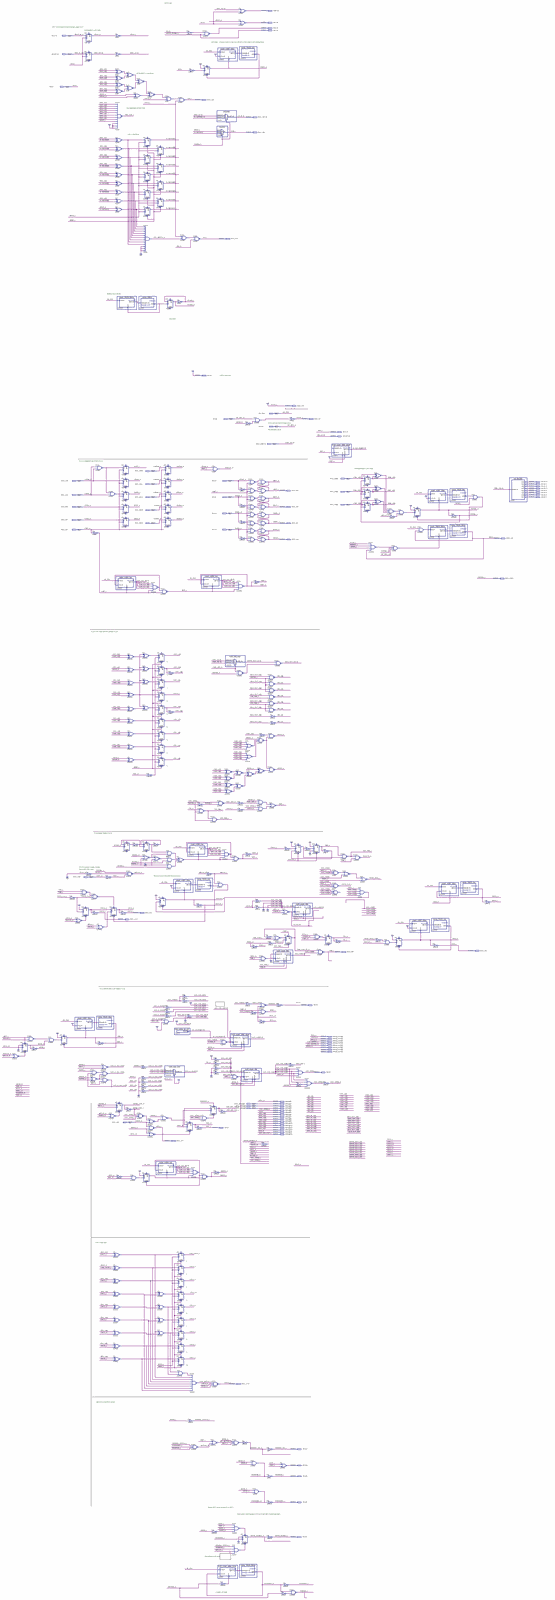
[diagram p0: schematic sheet, whole]
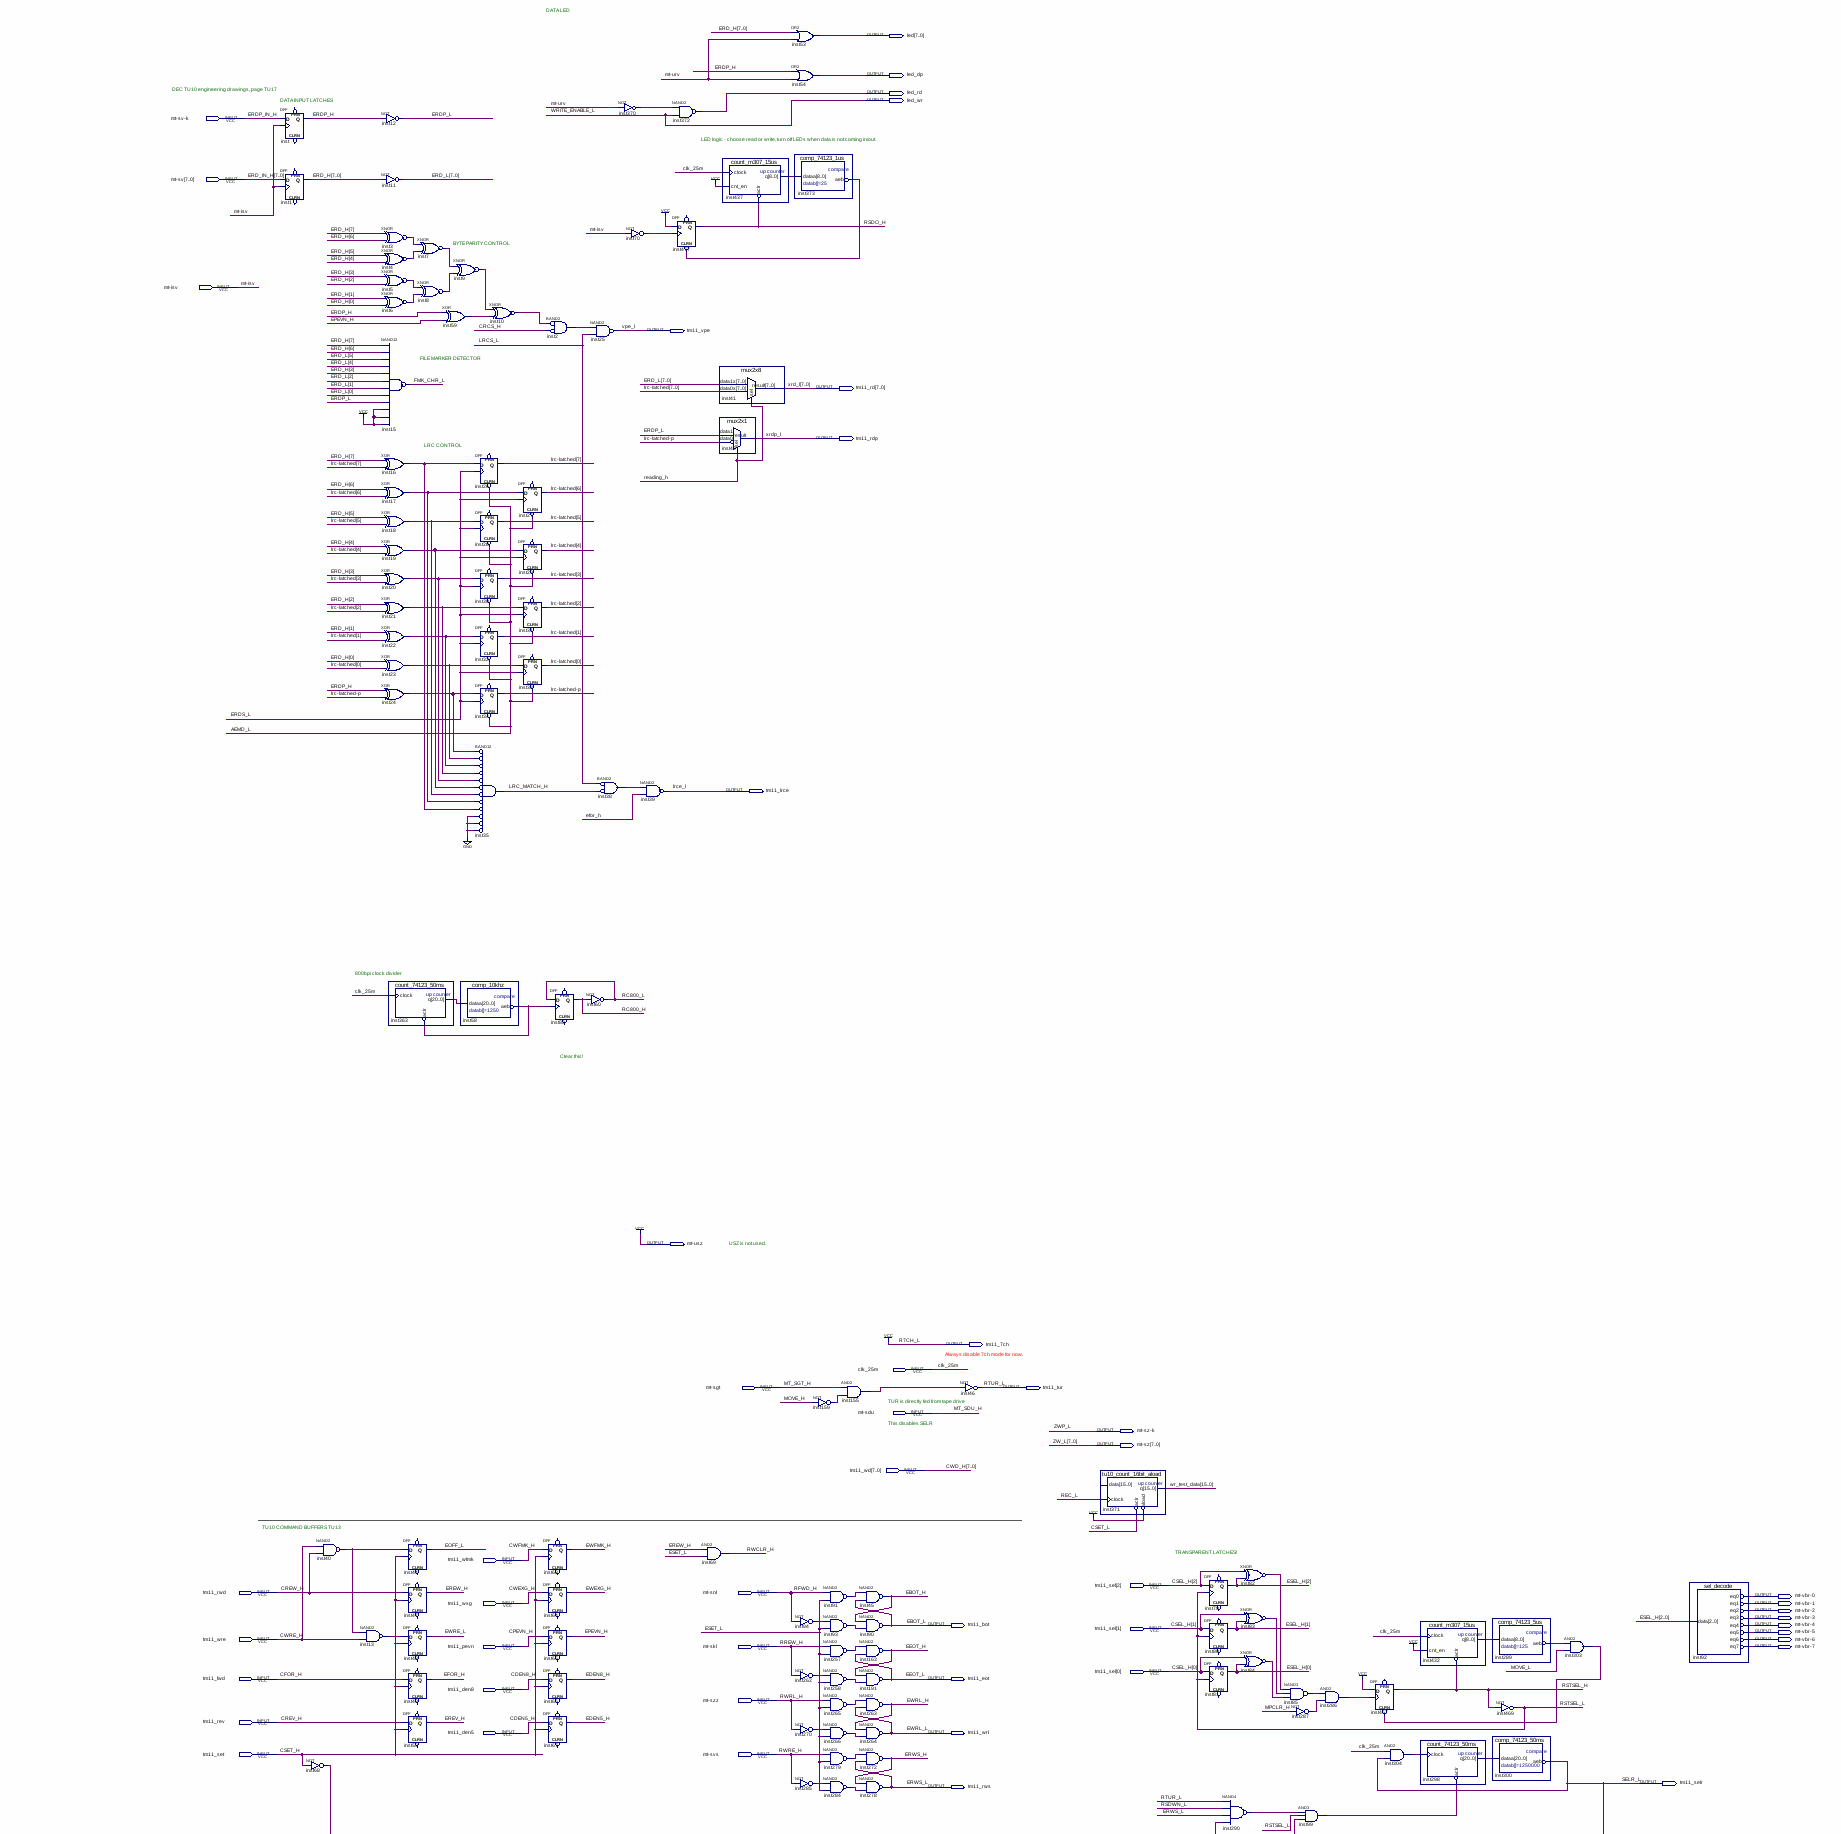
[diagram p1: schematic sheet, upper part]
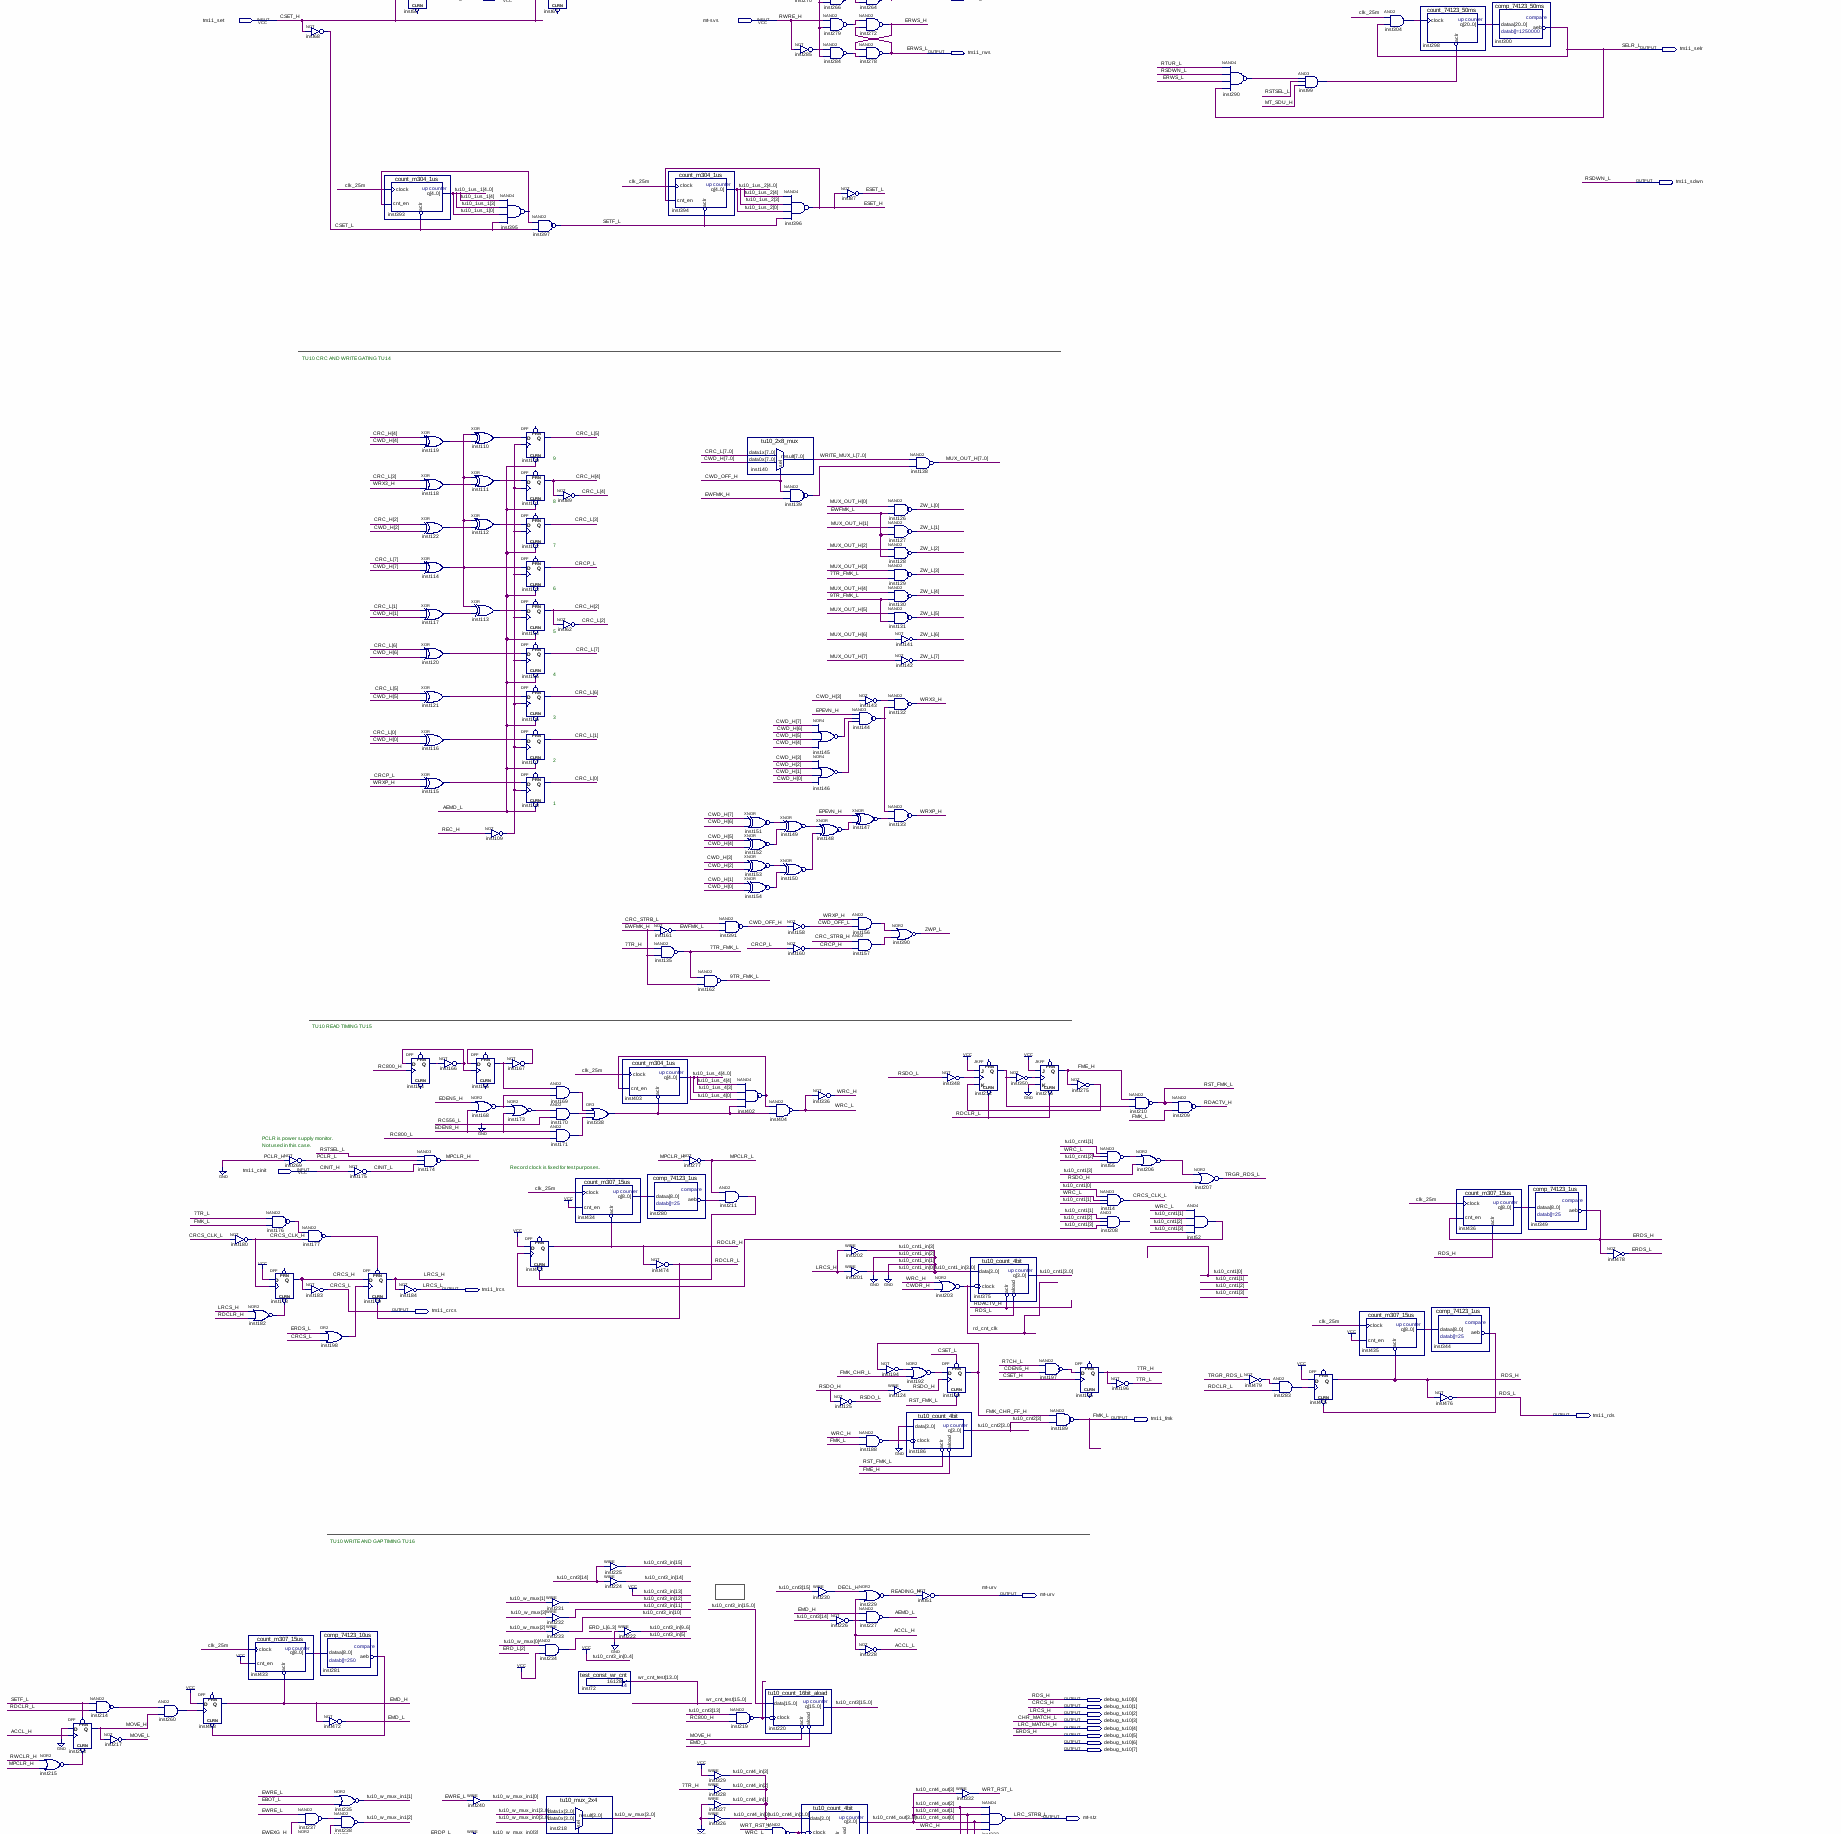
[diagram p2: schematic sheet, middle part]
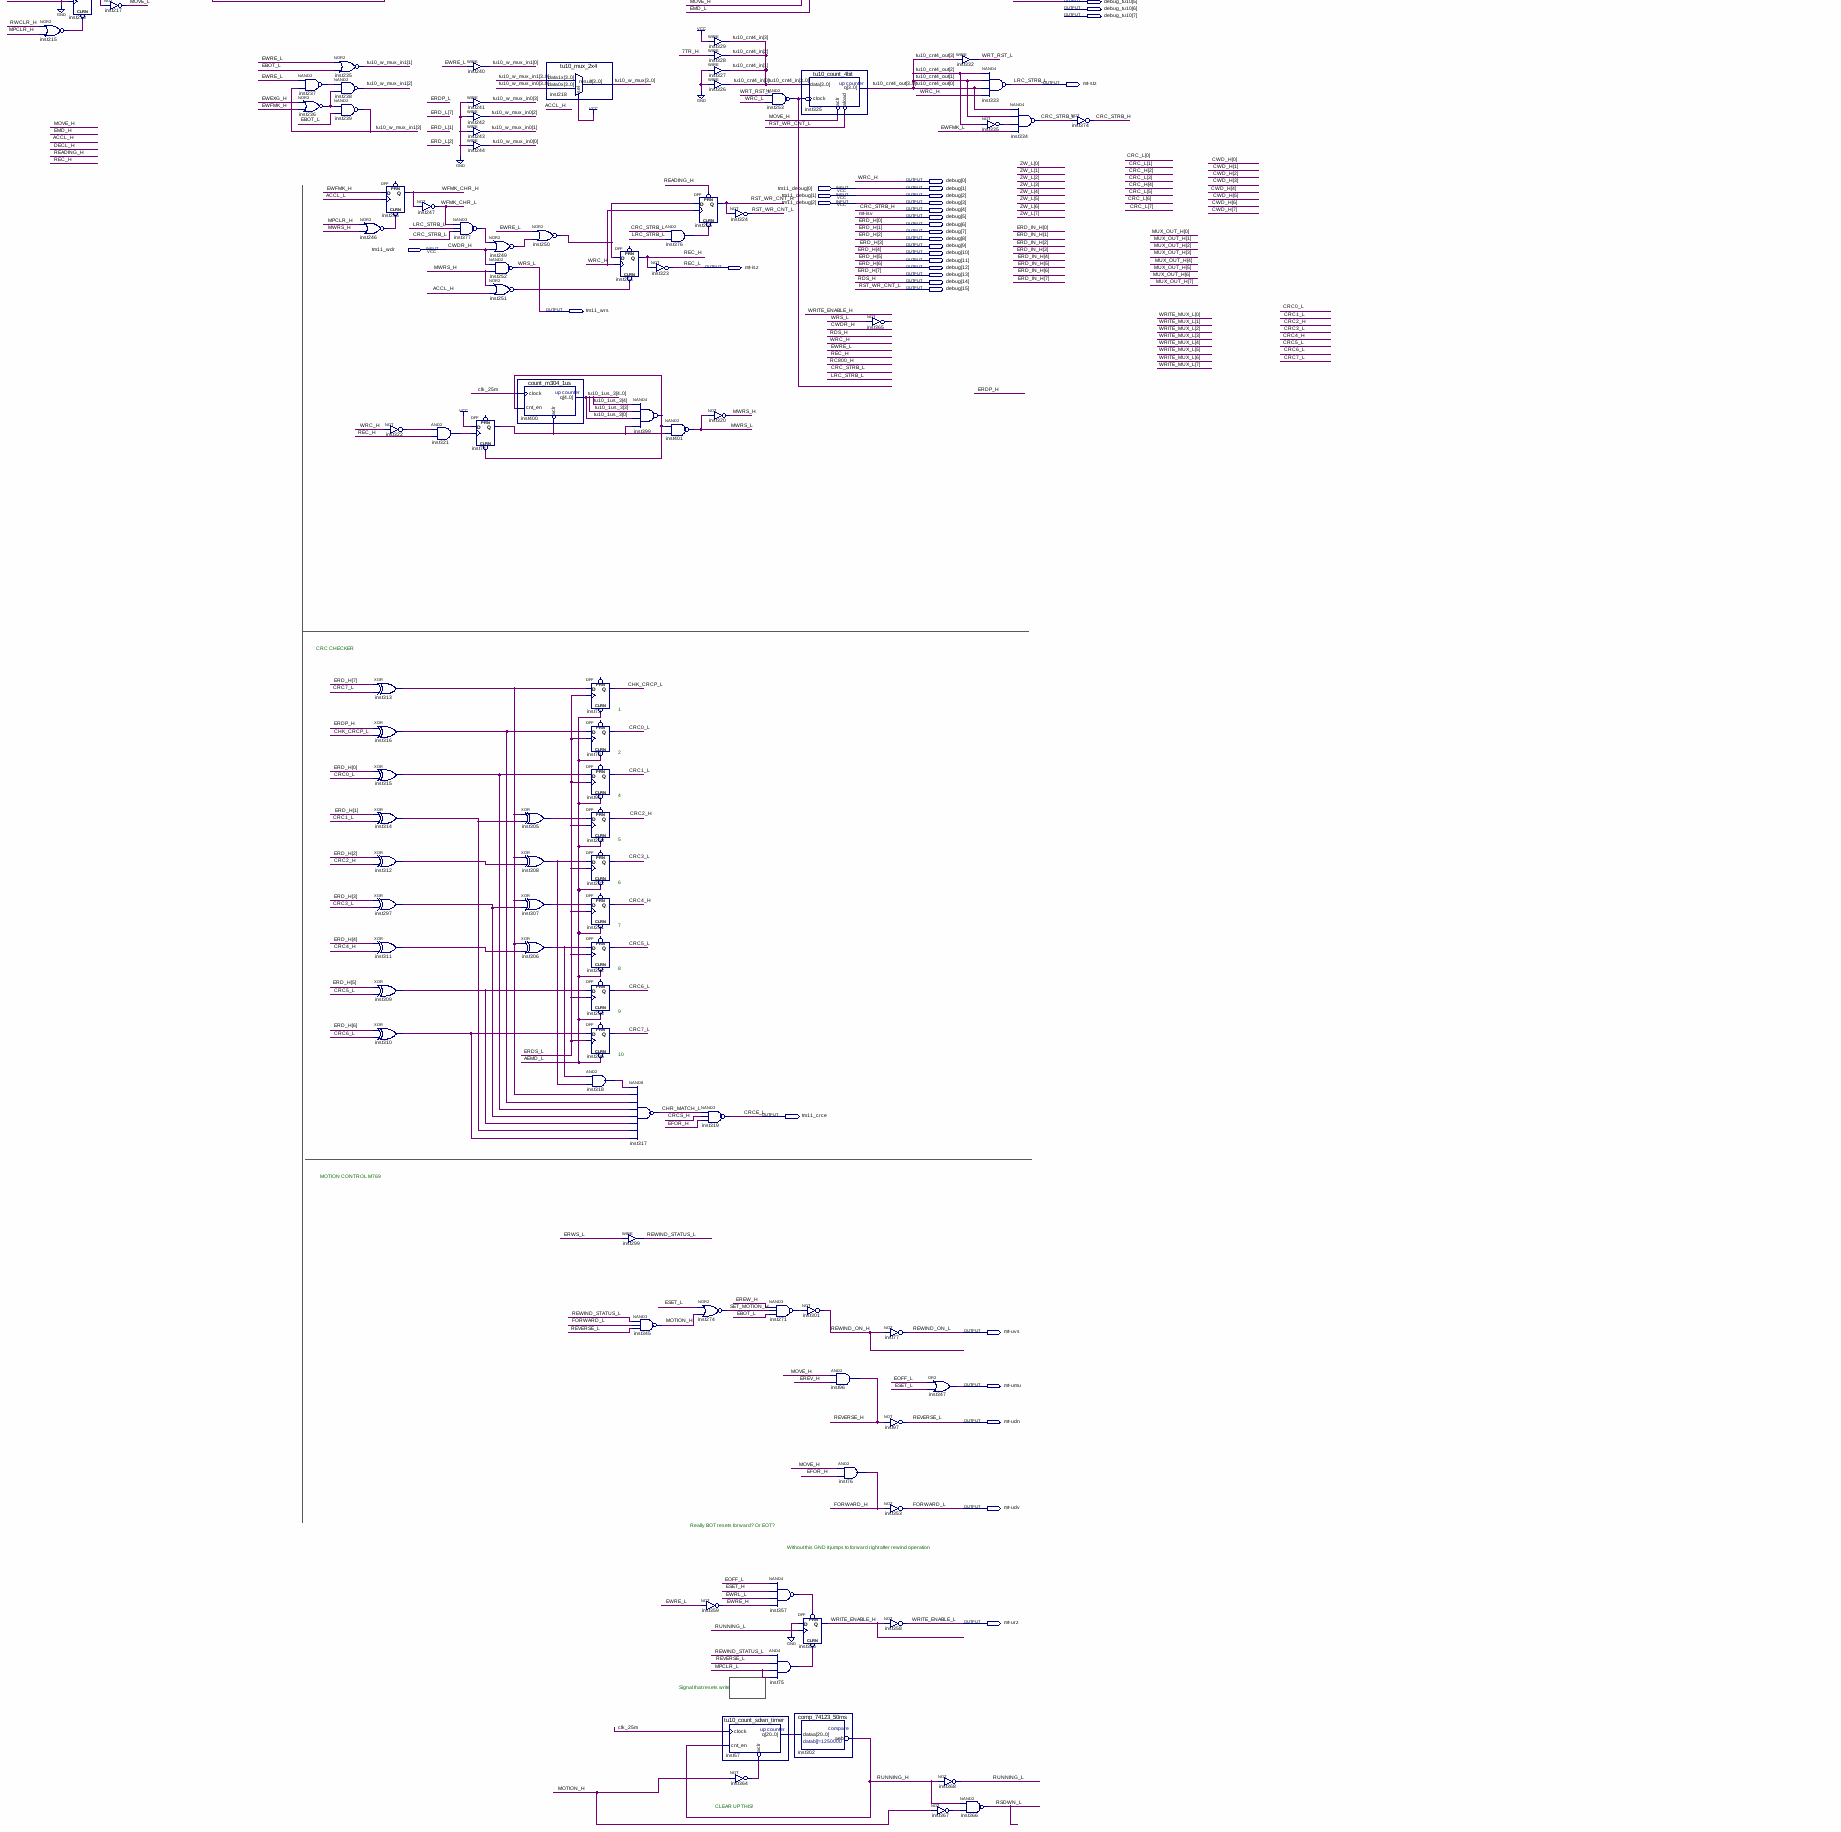
[diagram p3: schematic sheet, lower part]
// Quartus schematic tu10.bdf as structural Verilog: 358 symbols, 94 pins
module tu10 (
  input  \mt-sv-k ,
  input  [7:0] \mt-sv ,
  input  \mt-isv ,
  input  clk_25m,
  input  \mt-sgt ,
  input  \mt-sdu ,
  input  [7:0] tm11_wd,
  input  tm11_wfmk,
  input  [2:0] tm11_sel,
  input  tm11_rwd,
  input  \mt-snl ,
  input  tm11_wxg,
  input  tm11_wre,
  input  tm11_pevn,
  input  \mt-skl ,
  input  tm11_fwd,
  input  tm11_den8,
  input  \mt-szz ,
  input  tm11_rev,
  input  tm11_den5,
  input  tm11_set,
  input  \mt-svs ,
  input  tm11_cinit,
  input  [2:0] tm11_debug,
  input  tm11_wdr,
  output [7:0] led,
  output led_dp,
  output led_rd,
  output led_wr,
  output tm11_vpe,
  output [7:0] tm11_rd,
  output tm11_rdp,
  output tm11_lrce,
  output \mt-usz ,
  output tm11_7ch,
  output tm11_tur,
  output \mt-sz-k ,
  output [7:0] \mt-sz ,
  output \mt-vbr-0 ,
  output \mt-vbr-1 ,
  output \mt-vbr-2 ,
  output \mt-vbr-3 ,
  output tm11_bot,
  output \mt-vbr-4 ,
  output \mt-vbr-5 ,
  output \mt-vbr-6 ,
  output \mt-vbr-7 ,
  output tm11_eot,
  output tm11_wrl,
  output tm11_selr,
  output tm11_rws,
  output tm11_sdwn,
  output tm11_lrcs,
  output tm11_crcs,
  output tm11_rds,
  output tm11_fmk,
  output \mt-urv ,
  output [7:0] debug_tu10,
  output \mt-stz ,
  output [15:0] debug,
  output \mt-isz ,
  output tm11_wrs,
  output tm11_crce,
  output \mt-uvs ,
  output \mt-umu ,
  output \mt-udn ,
  output \mt-udv ,
  output \mt-urz 
);

  wire \7TR_FMK_L , \7TR_H , \7TR_L , \9TR_FMK_L , ACCL_H, ACCL_L, AEMD_L, CHK_CRCP_L, CINIT_L, CRC0_L,
       CRC1_L, CRC2_H, CRC3_L, CRC4_H, CRC5_L, CRC6_L, CRC7_L, CRC_STRB_L, CRCP_H, CRCP_L, CRCS_CLK_H,
       CRCS_CLK_L, CSET_L, CWD_OFF_H, CWD_OFF_L, DECL_H, EBOT_H, EDEN5_H, EDEN8_H, EEOT_H, efor_h, EMD_H,
       EMD_L, EOFF_L, EPEVN_H, ERDP_H, ERDP_L, ERDS_L, EREV_H, EREW_H, ERWS_H, ESET_H, ESET_L, EWEXG_H,
       EWFMK_H, EWFMK_L, EWRE_H, EWRE_L, EWRL_H, FME_H, FMK_CHR_FF_H, FMK_CHR_L, FORWARD_H, inst2_out,
       inst3_out, inst4_out, inst5_out, inst6_out, inst7_out, inst8_out, inst9_out, inst10_out, inst13_out,
       inst16_out, inst17_out, inst18_out, inst19_out, inst20_out, inst21_out, inst22_out, inst23_out,
       inst24_out, inst38_out, inst40_out, inst52_out, inst55_out, inst58_aeb, inst58_aeb_inverted_out,
       inst59_out, inst70_out, inst74_q, inst75_out, inst82_out, inst83_out, inst84_out, inst85_out,
       inst91_out, inst92_eq0, inst92_eq1, inst92_eq2, inst92_eq3, inst92_eq4, inst92_eq5, inst92_eq6,
       inst92_eq7, inst93_out, inst94_out, inst99_out, inst109_out, inst110_out, inst111_out, inst112_out,
       inst113_out, inst114_out, inst115_out, inst116_out, inst117_out, inst118_out, inst119_out,
       inst120_out, inst121_out, inst122_out, inst139_out, inst143_out, inst144_out, inst145_out,
       inst146_out, inst147_out, inst148_out, inst149_out, inst150_out, inst151_out, inst152_out,
       inst153_out, inst154_out, inst155_out, inst156_out, inst157_out, inst159_out, inst164_q, inst165_q,
       inst166_out, inst167_out, inst168_out, inst169_out, inst170_out, inst171_out, inst173_out,
       inst176_out, inst177_out, inst182_out, inst188_out, inst192_out, inst194_out, inst197_out,
       inst198_out, inst206_out, inst211_out, inst212_q, inst214_out, inst215_out, inst219_out, inst236_out,
       inst237_out, inst246_out, inst249_out, inst250_out, inst251_out, inst253_out, inst257_out,
       inst258_out, inst260_out, inst262_out, inst265_out, inst266_out, inst270_out, inst271_out,
       inst275_out, inst279_out, inst280_aeb, inst280_aeb_inverted_out, inst281_aeb,
       inst281_aeb_inverted_out, inst283_out, inst284_out, inst285_out, inst286_out, inst287_out,
       inst289_aeb, inst289_aeb_inverted_out, inst290_out, inst297_out, inst300_aeb, inst302_aeb,
       inst303_out, inst304_out, inst305_out, inst306_out, inst307_out, inst308_out, inst309_out,
       inst310_out, inst311_out, inst312_out, inst313_out, inst314_out, inst315_out, inst316_out,
       inst318_out, inst321_out, inst322_out, inst335_out, inst338_out, inst344_aeb,
       inst344_aeb_inverted_out, inst348_out, inst349_aeb, inst350_out, inst357_out, inst364_out,
       inst365_out, inst367_out, inst370_out, inst373_aeb, inst373_aeb_inverted_out, inst376_out,
       inst377_out, inst395_out, inst399_out, inst402_out, inst479_out, \lrc-latched-p , MOTION_H, MOVE_H,
       MOVE_L, MPCLR_H, MPCLR_L, MWRS_H, MWRS_L, PCLR_L, RC800_H, RC800_L, rd_cnt_clk, RDACTV_H, RDCLR_H,
       RDCLR_L, READING_H, REC_H, REVERSE_H, REWIND_ON_H, REWIND_STATUS_L, RSDO_H, RSDO_L, RST_FMK_L,
       RST_WR_CNT_H, RSTSEL_H, RSTSEL_L, RUNNING_H, RUNNING_L, RWCLR_H, SET_MOTION_H, SETF_L, TRGR_RDS_L,
       WFMK_CHR_H, WFMK_CHR_L, WRC_L, WRITE_ENABLE_H, WRT_RST_L, WRX3_H, WRXP_H;
  wire [2:0] ESEL_H;
  wire [3:0] tu10_cnt1, tu10_cnt1_in, tu10_cnt2, tu10_cnt4_in, tu10_cnt4_out, tu10_w_mux, tu10_w_mux_in0,
       tu10_w_mux_in1;
  wire [4:0] tu10_1us_1, tu10_1us_2, tu10_1us_3, tu10_1us_4;
  wire [4:2] CRC_H;
  wire [7:0] CRC_L, ERD_L, \lrc-latched , MUX_OUT_H, WRITE_MUX_L;
  wire [8:0] inst432_q, inst433_q, inst434_q, inst435_q, inst436_q, inst437_q;
  wire [13:0] wr_cnt_test;
  wire [15:0] tu10_cnt3, wr_test_data;
  wire [15:5] tu10_cnt3_in;
  wire [20:0] inst57_q, inst298_q, inst363_q;

  nor inst215 (inst215_out, RWCLR_H, MPCLR_H);
  DFF inst213 (.CLRN(inst215_out), .CLK(ACCL_H), .D(1'b0), .PRN(SETF_L), .Q(MOVE_H));
  nand inst214 (inst214_out, SETF_L, RDCLR_L);
  not inst217 (MOVE_L, MOVE_H);
  and inst260 (inst260_out, inst214_out, MOVE_H);
  DFF inst468 (.CLRN(inst281_aeb_inverted_out), .CLK(inst260_out), .D(1'b1), .Q(EMD_H));  // open: PRN
  not inst180 (CRCS_CLK_H, CRCS_CLK_L);
  nor inst182 (inst182_out, debug_tu10[2], RDCLR_H);
  count_m307_15us inst433 (.aclr(~EMD_H), .clock(clk_25m), .cnt_en(1'b1), .q(inst433_q));
  DFF inst (.CLK(\mt-isv ), .D(\mt-sv-k ), .Q(ERDP_H));  // open: CLRN, PRN
  DFF inst1[7:0] (.CLK(\mt-isv ), .D(\mt-sv ), .Q(debug[13:6]));  // open: CLRN, PRN
  nand inst176 (inst176_out, \7TR_L , tm11_fmk);
  DFF inst178 (.CLRN(inst182_out), .CLK(CRCS_CLK_H), .D(1'b1), .Q(debug_tu10[1]));  // open: PRN
  not inst68 (CSET_L, tm11_set);
  not inst269 (PCLR_L, 1'b0);
  nand inst177 (inst177_out, inst176_out, CRCS_CLK_H);
  not inst183 (tm11_crcs, debug_tu10[1]);
  nand inst237 (inst237_out, EWRE_L, tu10_w_mux_in1[3]);
  nor inst236 (inst236_out, EWEXG_H, EWFMK_H);
  nand inst40 (inst40_out, tm11_wre, tm11_rwd);
  or inst198 (inst198_out, ERDS_L, tm11_crcs);
  comp_74123_10us inst281 (.dataa(inst433_q), .aeb(inst281_aeb));
  not inst281_aeb_inverted (inst281_aeb_inverted_out, inst281_aeb);
  not inst472 (EMD_L, EMD_H);
  nor inst235 (tu10_w_mux_in1[1], EWRE_L, tm11_bot);
  nand inst238 (tu10_w_mux_in1[2], inst237_out, inst236_out);
  nand inst239 (tu10_w_mux_in1[3], inst236_out, tm11_bot);
  nand inst13 (inst13_out, inst40_out, tm11_wre);
  not inst175 (CINIT_L, tm11_cinit);
  DFF inst179 (.CLRN(RDCLR_L), .CLK(inst198_out), .D(debug_tu10[1]), .PRN(inst177_out), .Q(debug_tu10[2]));
  nor inst246 (inst246_out, MPCLR_H, MWRS_H);
  not inst12 (ERDP_L, ERDP_H);
  assign ERD_L = ~debug[13:6];  // NOT inst11, 8 bits wide
  xnor inst3 (inst3_out, debug[13], debug[12]);
  xnor inst4 (inst4_out, debug[11], debug[10]);
  xnor inst5 (inst5_out, debug[9], debug[8]);
  xnor inst6 (inst6_out, debug[7], debug[6]);
  nand inst15 (FMK_CHR_L, debug[13], debug[12], ERD_L[5], ERD_L[4], debug[9], ERD_L[2], ERD_L[1], ERD_L[0], ERDP_L, 1'b1, 1'b1, 1'b1);
  xor inst16 (inst16_out, debug[13], \lrc-latched [7]);
  xor inst17 (inst17_out, debug[12], \lrc-latched [6]);
  xor inst18 (inst18_out, debug[11], \lrc-latched [5]);
  xor inst19 (inst19_out, debug[10], \lrc-latched [4]);
  xor inst20 (inst20_out, debug[9], \lrc-latched [3]);
  xor inst21 (inst21_out, debug[8], \lrc-latched [2]);
  xor inst22 (inst22_out, debug[7], \lrc-latched [1]);
  xor inst23 (inst23_out, debug[6], \lrc-latched [0]);
  xor inst24 (inst24_out, ERDP_H, \lrc-latched-p );
  count_74123_50ms inst363 (.aclr(~inst58_aeb_inverted_out), .clock(clk_25m), .q(inst363_q));
  count_m304_1us inst393 (.aclr(~CSET_L), .clock(clk_25m), .cnt_en(inst395_out), .q(tu10_1us_1));
  DFF inst245 (.CLRN(inst246_out), .CLK(ACCL_L), .D(EWFMK_H), .Q(WFMK_CHR_H));  // open: PRN
  not inst322 (inst322_out, debug[0]);
  xor inst313 (inst313_out, debug[13], CRC7_L);
  xor inst316 (inst316_out, ERDP_H, CHK_CRCP_L);
  xor inst315 (inst315_out, debug[6], CRC0_L);
  xor inst314 (inst314_out, debug[7], CRC1_L);
  xor inst312 (inst312_out, debug[8], CRC2_H);
  xor inst297 (inst297_out, debug[9], CRC3_L);
  xor inst311 (inst311_out, debug[10], CRC4_H);
  xor inst309 (inst309_out, debug[11], CRC5_L);
  xor inst310 (inst310_out, debug[12], CRC6_L);
  xnor inst7 (inst7_out, inst3_out, inst4_out);
  xnor inst8 (inst8_out, inst5_out, inst6_out);
  DFF inst44 (.CLK(tm11_set), .D(inst40_out), .Q(EOFF_L));  // open: CLRN, PRN
  DFF inst47 (.CLK(tm11_set), .D(tm11_rwd), .Q(EREW_H));  // open: CLRN, PRN
  DFF inst48 (.CLK(tm11_set), .D(inst13_out), .Q(EWRE_L));  // open: CLRN, PRN
  DFF inst49 (.CLK(tm11_set), .D(tm11_fwd), .Q(efor_h));  // open: CLRN, PRN
  DFF inst50 (.CLK(tm11_set), .D(tm11_rev), .Q(EREV_H));  // open: CLRN, PRN
  xor inst119 (inst119_out, CRC_H[4], tm11_wd[4]);
  xor inst118 (inst118_out, CRC_L[3], WRX3_H);
  xor inst122 (inst122_out, CRC_H[2], tm11_wd[2]);
  xor inst114 (inst114_out, CRC_L[7], tm11_wd[7]);
  xor inst117 (inst117_out, CRC_L[1], tm11_wd[1]);
  xor inst120 (inst120_out, CRC_L[6], tm11_wd[6]);
  xor inst121 (inst121_out, CRC_L[5], tm11_wd[5]);
  xor inst116 (inst116_out, CRC_L[0], tm11_wd[0]);
  xor inst115 (inst115_out, CRCP_L, WRXP_H);
  DFF inst164 (.CLK(RC800_H), .D(inst166_out), .Q(inst164_q));  // open: CLRN, PRN
  nand inst174 (MPCLR_H, RSTSEL_L, PCLR_L, CINIT_L);
  not inst184 (tm11_lrcs, debug_tu10[2]);
  not inst247 (WFMK_CHR_L, WFMK_CHR_H);
  xnor inst9 (inst9_out, inst7_out, inst8_out);
  xor inst59 (inst59_out, ERDP_H, EPEVN_H);
  not inst166 (inst166_out, inst164_q);
  nand inst377 (inst377_out, WFMK_CHR_L, \mt-stz , CRC_STRB_L);
  and inst321 (inst321_out, inst322_out, REC_H);
  DFF inst26 (.CLRN(AEMD_L), .CLK(ERDS_L), .D(inst16_out), .Q(\lrc-latched [7]));  // open: PRN
  DFF inst28 (.CLRN(AEMD_L), .CLK(ERDS_L), .D(inst18_out), .Q(\lrc-latched [5]));  // open: PRN
  DFF inst30 (.CLRN(AEMD_L), .CLK(ERDS_L), .D(inst20_out), .Q(\lrc-latched [3]));  // open: PRN
  DFF inst32 (.CLRN(AEMD_L), .CLK(ERDS_L), .D(inst22_out), .Q(\lrc-latched [1]));  // open: PRN
  DFF inst34 (.CLRN(AEMD_L), .CLK(ERDS_L), .D(inst24_out), .Q(\lrc-latched-p ));  // open: PRN
  and inst35 (debug_tu10[4], ~inst24_out, ~inst23_out, ~inst22_out, ~inst21_out, ~inst20_out, ~inst19_out, ~inst18_out, ~inst17_out, ~inst16_out, ~1'b0, ~1'b0, ~1'b0);  // BAND12
  comp_10khz inst58 (.dataa(inst363_q), .aeb(inst58_aeb));
  not inst58_aeb_inverted (inst58_aeb_inverted_out, inst58_aeb);
  xor inst110 (inst110_out, inst114_out, inst119_out);
  xor inst111 (inst111_out, inst114_out, inst118_out);
  xor inst112 (inst112_out, inst114_out, inst122_out);
  xor inst113 (inst113_out, inst114_out, inst117_out);
  DFF inst165 (.CLK(inst166_out), .D(inst167_out), .Q(inst165_q));  // open: CLRN, PRN
  nor inst168 (inst168_out, EDEN5_H, EDEN8_H);
  assign tu10_w_mux_in1[0] = EWRE_L;  // WIRE inst240
  assign tu10_w_mux_in0[3] = 1'b0;  // WIRE inst241
  assign tu10_w_mux_in0[2] = 1'b0;  // WIRE inst242
  assign tu10_w_mux_in0[1] = 1'b0;  // WIRE inst243
  assign tu10_w_mux_in0[0] = 1'b0;  // WIRE inst244
  DFF inst74 (.CLRN(inst399_out), .CLK(inst321_out), .D(1'b1), .Q(inst74_q));  // open: PRN
  xnor inst10 (inst10_out, inst9_out, inst59_out);
  nand inst395 (inst395_out, tu10_1us_1[4], tu10_1us_1[3], tu10_1us_1[0], CSET_L);
  not inst109 (inst109_out, REC_H);
  not inst167 (inst167_out, inst165_q);
  nor inst173 (inst173_out, inst168_out, EDEN8_H);
  nor inst249 (inst249_out, inst377_out, tm11_wdr);
  nand inst252 (tm11_wrs, tm11_wdr, MWRS_H);
  nor inst251 (inst251_out, MWRS_H, ACCL_H);
  DFF inst27 (.CLRN(AEMD_L), .CLK(ERDS_L), .D(inst17_out), .Q(\lrc-latched [6]));  // open: PRN
  DFF inst29 (.CLRN(AEMD_L), .CLK(ERDS_L), .D(inst19_out), .Q(\lrc-latched [4]));  // open: PRN
  DFF inst31 (.CLRN(AEMD_L), .CLK(ERDS_L), .D(inst21_out), .Q(\lrc-latched [2]));  // open: PRN
  DFF inst33 (.CLRN(AEMD_L), .CLK(ERDS_L), .D(inst23_out), .Q(\lrc-latched [0]));  // open: PRN
  nand inst397 (SETF_L, inst395_out, CSET_L);
  DFF inst100 (.CLRN(AEMD_L), .CLK(inst109_out), .D(inst110_out), .Q(CRC_L[5]));  // open: PRN
  DFF inst101 (.CLRN(AEMD_L), .CLK(inst109_out), .D(inst111_out), .Q(CRC_H[4]));  // open: PRN
  DFF inst102 (.CLRN(AEMD_L), .CLK(inst109_out), .D(inst112_out), .Q(CRC_L[3]));  // open: PRN
  DFF inst103 (.CLRN(AEMD_L), .CLK(inst109_out), .D(inst114_out), .Q(CRCP_L));  // open: PRN
  DFF inst104 (.CLRN(AEMD_L), .CLK(inst109_out), .D(inst113_out), .Q(CRC_H[2]));  // open: PRN
  DFF inst105 (.CLRN(AEMD_L), .CLK(inst109_out), .D(inst120_out), .Q(CRC_L[7]));  // open: PRN
  DFF inst106 (.CLRN(AEMD_L), .CLK(inst109_out), .D(inst121_out), .Q(CRC_L[6]));  // open: PRN
  DFF inst107 (.CLRN(AEMD_L), .CLK(inst109_out), .D(inst116_out), .Q(CRC_L[1]));  // open: PRN
  DFF inst108 (.CLRN(AEMD_L), .CLK(inst109_out), .D(inst115_out), .Q(CRC_L[0]));  // open: PRN
  DFF inst473 (.CLRN(inst211_out), .CLK(inst52_out), .D(1'b1), .Q(RDCLR_H));  // open: PRN
  and inst234 (tu10_cnt3_in[5], tu10_w_mux[0], 1'b1);
  nor inst250 (inst250_out, EWRE_L, inst249_out);
  count_m304_1us inst400 (.aclr(~inst74_q), .clock(clk_25m), .cnt_en(inst399_out), .q(tu10_1us_3));
  xor inst305 (inst305_out, inst313_out, inst314_out);
  xor inst308 (inst308_out, inst313_out, inst312_out);
  xor inst307 (inst307_out, inst313_out, inst297_out);
  xor inst306 (inst306_out, inst313_out, inst311_out);
  and inst2 (inst2_out, ~inst10_out, ~debug_tu10[1]);  // BAND2
  DFF inst88 (.CLK(inst58_aeb_inverted_out), .D(RC800_L), .Q(RC800_H));  // open: CLRN, PRN
  DFF inst63 (.CLK(tm11_set), .D(tm11_wfmk), .Q(EWFMK_H));  // open: CLRN, PRN
  DFF inst64 (.CLK(tm11_set), .D(tm11_wxg), .Q(EWEXG_H));  // open: CLRN, PRN
  DFF inst65 (.CLK(tm11_set), .D(tm11_pevn), .Q(EPEVN_H));  // open: CLRN, PRN
  DFF inst66 (.CLK(tm11_set), .D(tm11_den8), .Q(EDEN8_H));  // open: CLRN, PRN
  DFF inst67 (.CLK(tm11_set), .D(tm11_den5), .Q(EDEN5_H));  // open: CLRN, PRN
  not inst89 (CRC_L[4], CRC_H[4]);
  not inst62 (CRC_L[2], CRC_H[2]);
  and inst169 (inst169_out, inst165_q, inst168_out);
  and inst170 (inst170_out, inst173_out, 1'b0);
  and inst171 (inst171_out, EDEN8_H, RC800_L);
  assign tu10_cnt3_in[12] = tu10_w_mux[1];  // WIRE inst231
  assign tu10_cnt3_in[11] = tu10_w_mux[3];  // WIRE inst232
  assign tu10_cnt3_in[10] = tu10_w_mux[2];  // WIRE inst233
  tu10_mux_2x4 inst218 (.data0x(tu10_w_mux_in0), .data1x(tu10_w_mux_in1), .sel(1'b1), .result(tu10_w_mux));
  nand inst25 (tm11_vpe, inst2_out, tm11_lrcs);
  and inst38 (inst38_out, ~tm11_lrcs, ~debug_tu10[4]);  // BAND2
  not inst60 (RC800_L, RC800_H);
  or inst338 (inst338_out, inst169_out, inst170_out, inst171_out);
  count_m307_15us inst434 (.aclr(~RDCLR_H), .clock(clk_25m), .cnt_en(1'b1), .q(inst434_q));
  test_const_wr_cnt inst72 (.result(wr_cnt_test));
  DFF inst73 (.CLRN(AEMD_L), .CLK(ERDS_L), .D(inst313_out), .Q(CHK_CRCP_L));  // open: PRN
  DFF inst78 (.CLRN(AEMD_L), .CLK(ERDS_L), .D(inst316_out), .Q(CRC0_L));  // open: PRN
  DFF inst95 (.CLRN(AEMD_L), .CLK(ERDS_L), .D(inst315_out), .Q(CRC1_L));  // open: PRN
  DFF inst268 (.CLRN(AEMD_L), .CLK(ERDS_L), .D(inst305_out), .Q(CRC2_H));  // open: PRN
  DFF inst282 (.CLRN(AEMD_L), .CLK(ERDS_L), .D(inst308_out), .Q(CRC3_L));  // open: PRN
  DFF inst291 (.CLRN(AEMD_L), .CLK(ERDS_L), .D(inst307_out), .Q(CRC4_H));  // open: PRN
  DFF inst292 (.CLRN(AEMD_L), .CLK(ERDS_L), .D(inst306_out), .Q(CRC5_L));  // open: PRN
  DFF inst293 (.CLRN(AEMD_L), .CLK(ERDS_L), .D(inst309_out), .Q(CRC6_L));  // open: PRN
  DFF inst296 (.CLRN(AEMD_L), .CLK(ERDS_L), .D(inst310_out), .Q(CRC7_L));  // open: PRN
  and inst318 (inst318_out, inst306_out, inst308_out);
  not inst370 (inst370_out, \mt-urv );
  not inst70 (inst70_out, \mt-isv );
  count_m304_1us inst403 (.aclr(~inst338_out), .clock(clk_25m), .cnt_en(inst402_out), .q(tu10_1us_4));
  assign tu10_cnt3_in[15] = tu10_cnt3[14];  // WIRE inst225
  assign tu10_cnt3_in[14] = tu10_cnt3[14];  // WIRE inst224
  assign tu10_cnt3_in[9:6] = 4'b0000;  // WIRE inst222
  DFF inst254 (.CLRN(inst251_out), .CLK(debug[0]), .D(inst250_out), .Q(REC_H));  // open: PRN
  assign REWIND_STATUS_L = tm11_rws;  // WIRE inst299
  nand inst39 (tm11_lrce, inst38_out, efor_h);
  not inst161 (EWFMK_L, EWFMK_H);
  nand inst135 (\7TR_FMK_L , \7TR_H , EWFMK_H);
  comp_74123_1us inst280 (.dataa(inst434_q), .aeb(inst280_aeb));
  not inst280_aeb_inverted (inst280_aeb_inverted_out, inst280_aeb);
  not inst474 (RDCLR_L, RDCLR_H);
  not inst323 (\mt-isz , REC_H);
  nand inst399 (inst399_out, tu10_1us_3[4], tu10_1us_3[3], tu10_1us_3[0], inst74_q);
  nand inst317 (debug_tu10[3], inst318_out, inst313_out, inst316_out, inst315_out, inst297_out, inst309_out, inst314_out, inst310_out);
  nand inst345 (MOTION_H, REWIND_STATUS_L, \mt-udv , \mt-udn );
  nand inst372 (led_rd, inst370_out, led_wr);
  DFF inst477 (.CLRN(inst373_aeb_inverted_out), .CLK(inst70_out), .D(1'b1), .Q(RSDO_H));  // open: PRN
  count_m304_1us inst394 (.aclr(~SETF_L), .clock(clk_25m), .cnt_en(ESET_H), .q(tu10_1us_2));
  not inst277 (MPCLR_L, MPCLR_H);
  and inst376 (inst376_out, CRC_STRB_L, \mt-stz );
  nand inst401 (MWRS_L, inst399_out, inst74_q);
  and inst69 (RWCLR_H, EREW_H, ESET_L);
  nand inst162 (\9TR_FMK_L , \7TR_FMK_L , EWFMK_H);
  assign tu10_cnt4_in[3] = 1'b1;  // WIRE inst329
  assign tu10_cnt4_in[2] = \7TR_H ;  // WIRE inst328
  assign tu10_cnt4_in[1] = 1'b0;  // WIRE inst327
  assign tu10_cnt4_in[0] = 1'b0;  // WIRE inst326
  DFF inst255 (.CLRN(inst376_out), .CLK(debug[0]), .D(inst250_out), .PRN(READING_H), .Q(RST_WR_CNT_H));
  not inst320 (MWRS_H, MWRS_L);
  nand inst319 (tm11_crce, debug_tu10[3], debug_tu10[1], efor_h);
  nor inst274 (SET_MOTION_H, ESET_L, MOTION_H);
  not inst359 (EWRE_H, EWRE_L);
  count_m307_15us inst437 (.aclr(~RSDO_H), .clock(clk_25m), .cnt_en(1'b1), .q(inst437_q));
  mux2x8 inst41 (.data0x(\lrc-latched ), .data1x(ERD_L), .sel(READING_H), .result(tm11_rd));
  mux2x1 inst42 (.data0(~\lrc-latched-p ), .data1(ERDP_L), .sel(READING_H), .result(tm11_rdp));
  nand inst391 (CWD_OFF_H, CRC_STRB_L, EWFMK_L);
  nand inst402 (inst402_out, tu10_1us_4[4], tu10_1us_4[3], tu10_1us_4[0], inst338_out);
  and inst211 (inst211_out, MPCLR_L, inst280_aeb_inverted_out);
  nand inst219 (inst219_out, tu10_cnt3[13], RC800_H);
  not inst324 (debug[15], RST_WR_CNT_H);
  tu10_count_sdwn_timer inst57 (.aclr(~inst364_out), .clock(clk_25m), .cnt_en(RUNNING_H), .q(inst57_q));
  not inst364 (inst364_out, MOTION_H);
  tu10_2x8_mux inst140 (.data0x(tm11_wd), .data1x(CRC_L), .sel(CWD_OFF_H), .result(WRITE_MUX_L));
  xnor inst151 (inst151_out, tm11_wd[7], tm11_wd[6]);
  xnor inst152 (inst152_out, tm11_wd[5], tm11_wd[4]);
  xnor inst153 (inst153_out, tm11_wd[3], tm11_wd[2]);
  xnor inst154 (inst154_out, tm11_wd[1], tm11_wd[0]);
  nand inst404 (WRC_L, inst402_out, inst338_out);
  tu10_count_16bit_aload inst220 (
    .aclr(~MOVE_H), .aload(~EMD_L), .clock(~inst219_out),
    .data({tu10_cnt3_in[15:14], 1'b1, tu10_cnt3_in[12:5], {5{1'b1}}}), .q(tu10_cnt3));
  nand inst253 (inst253_out, WRT_RST_L, WRC_L);
  nand inst271 (inst271_out, EREW_H, SET_MOTION_H, tm11_bot);
  nand inst357 (inst357_out, EOFF_L, ESET_H, tm11_wrl, EWRE_H);
  and inst75 (inst75_out, REWIND_STATUS_L, \mt-udn , MPCLR_L, MPCLR_L);
  assign led = debug[13:6] | {8{\mt-urv }};  // OR2 inst53, 8 bits wide
  or inst54 (led_dp, ERDP_H, \mt-urv );
  comp_74123_1us inst373 (.dataa(inst437_q), .aeb(inst373_aeb));
  not inst373_aeb_inverted (inst373_aeb_inverted_out, inst373_aeb);
  not inst94 (inst94_out, \mt-snl );
  not inst262 (inst262_out, \mt-skl );
  not inst270 (inst270_out, \mt-szz );
  not inst285 (inst285_out, \mt-svs );
  nand inst396 (ESET_H, tu10_1us_2[4], tu10_1us_2[3], tu10_1us_2[0], SETF_L);
  nand inst139 (inst139_out, CWD_OFF_H, EWFMK_H);
  xnor inst149 (inst149_out, inst151_out, inst152_out);
  xnor inst150 (inst150_out, inst153_out, inst154_out);
  not inst158 (CWD_OFF_L, CWD_OFF_H);
  not inst160 (CRCP_H, CRCP_L);
  DFF inst356 (.CLRN(inst75_out), .CLK(RUNNING_L), .D(1'b0), .PRN(inst357_out), .Q(WRITE_ENABLE_H));
  comp_74123_50ms inst302 (.dataa(inst57_q), .aeb(inst302_aeb));
  not inst302_aeb_inverted (RUNNING_H, inst302_aeb);
  not inst159 (inst159_out, MOVE_H);
  nand inst91 (inst91_out, \mt-snl , ESET_L);
  nand inst93 (inst93_out, inst94_out, ESET_L);
  nand inst257 (inst257_out, \mt-skl , ESET_L);
  nand inst258 (inst258_out, inst262_out, ESET_L);
  nand inst265 (inst265_out, \mt-szz , ESET_L);
  nand inst266 (inst266_out, inst270_out, ESET_L);
  nand inst279 (inst279_out, \mt-svs , ESET_L);
  nand inst284 (inst284_out, inst285_out, ESET_L);
  nor inst145 (inst145_out, tm11_wd[7], tm11_wd[6], tm11_wd[5], tm11_wd[4]);
  nor inst146 (inst146_out, tm11_wd[3], tm11_wd[2], tm11_wd[1], tm11_wd[0]);
  xnor inst148 (inst148_out, inst149_out, inst150_out);
  not inst336 (debug[0], WRC_L);
  assign DECL_H = tu10_cnt3[15];  // WIRE inst230
  tu10_count_4bit inst325 (
    .aclr(~MOVE_H), .aload(~debug[15]), .clock(~inst253_out), .data(tu10_cnt4_in), .q(tu10_cnt4_out));
  not inst301 (REWIND_ON_H, inst271_out);
  and inst155 (inst155_out, \mt-sgt , inst159_out);
  not inst87 (ESET_L, ESET_H);
  nand inst144 (inst144_out, EPEVN_H, inst145_out, inst146_out);
  xnor inst147 (inst147_out, EPEVN_H, inst148_out);
  and inst156 (inst156_out, WRXP_H, CWD_OFF_L);
  and inst157 (inst157_out, debug[4], CRCP_H);
  assign tu10_cnt1_in[3] = debug_tu10[2];  // WIRE inst202
  assign tu10_cnt1_in[0] = debug_tu10[2];  // WIRE inst201
  not inst125 (RSDO_L, RSDO_H);
  not inst226 (ACCL_H, tu10_cnt3[14]);
  and inst96 (REVERSE_H, MOVE_H, EREV_H);
  and inst76 (FORWARD_H, MOVE_H, efor_h);
  nand inst45 (EBOT_H, inst91_out, tm11_bot);
  nand inst90 (tm11_bot, EBOT_H, inst93_out);
  nand inst163 (EEOT_H, inst257_out, tm11_eot);
  nand inst191 (tm11_eot, EEOT_H, inst258_out);
  nand inst263 (EWRL_H, inst265_out, tm11_wrl);
  nand inst264 (tm11_wrl, EWRL_H, inst266_out);
  nand inst272 (ERWS_H, inst279_out, tm11_rws);
  nand inst278 (tm11_rws, ERWS_H, inst284_out);
  not inst143 (inst143_out, tm11_wd[3]);
  not inst194 (inst194_out, FMK_CHR_FF_H);
  nand inst188 (inst188_out, debug[0], tm11_fmk);
  nor inst229 (READING_H, DECL_H, ACCL_H);
  nand inst227 (AEMD_L, EMD_H, ACCL_H);
  not inst228 (ACCL_L, ACCL_H);
  not inst365 (inst365_out, tm11_wrs);
  not inst77 (\mt-uvs , REWIND_ON_H);
  not inst97 (\mt-udn , REVERSE_H);
  not inst353 (\mt-udv , FORWARD_H);
  not inst358 (led_wr, WRITE_ENABLE_H);
  assign MUX_OUT_H = ~(WRITE_MUX_L & {8{inst139_out}});  // NAND2 inst138, 8 bits wide
  nand inst126 (\mt-sz [0], MUX_OUT_H[0], EWFMK_L);
  nand inst127 (\mt-sz [1], MUX_OUT_H[1], EWFMK_L);
  nand inst128 (\mt-sz [2], MUX_OUT_H[2], EWFMK_L);
  nand inst129 (\mt-sz [3], MUX_OUT_H[3], \7TR_FMK_L );
  nand inst130 (\mt-sz [4], MUX_OUT_H[4], \9TR_FMK_L );
  nand inst131 (\mt-sz [5], MUX_OUT_H[5], \9TR_FMK_L );
  not inst141 (\mt-sz [6], MUX_OUT_H[6]);
  not inst142 (\mt-sz [7], MUX_OUT_H[7]);
  nand inst132 (WRX3_H, inst143_out, inst144_out);
  nand inst133 (WRXP_H, inst144_out, inst147_out);
  nor inst390 (\mt-sz-k , inst156_out, inst157_out);
  nor inst192 (inst192_out, inst194_out, FMK_CHR_L);
  assign RSDO_H = RSDO_H;  // WIRE inst124
  tu10_count_4bit inst186 (.aclr(~RST_FMK_L), .aload(~FME_H), .clock(~inst188_out), .data(4'b0000), .q(tu10_cnt2));
  not inst348 (inst348_out, RSDO_L);
  nor inst203 (rd_cnt_clk, debug[0], tm11_wdr);
  DFF inst190 (.CLRN(RST_FMK_L), .CLK(RSDO_H), .D(inst192_out), .PRN(CSET_L), .Q(FMK_CHR_FF_H));
  not inst51 (\mt-urv , READING_H);
  or inst347 (\mt-umu , EOFF_L, ESET_L);
  not inst368 (RUNNING_L, RUNNING_H);
  not inst367 (inst367_out, MOTION_H);
  not inst46 (tm11_tur, inst155_out);
  tu10_count_4bit inst375 (
    .aclr(~RDACTV_H), .aload(~tm11_rds), .clock(~rd_cnt_clk),
    .data({tu10_cnt1_in[3], 2'b00, tu10_cnt1_in[0]}), .q(tu10_cnt1));
  assign WRT_RST_L = tu10_cnt4_out[3];  // WIRE inst332
  nand inst366 (tm11_sdwn, RUNNING_H, inst367_out);
  JKFF inst212 (.CLRN(RDCLR_L), .K(inst275_out), .J(1'b1), .CLK(inst348_out), .Q(inst212_q));  // open: PRN
  nand inst333 (\mt-stz , tu10_cnt4_out[2], tu10_cnt4_out[1], tu10_cnt4_out[0], debug[0]);
  not inst335 (inst335_out, tu10_cnt4_out[2]);
  not inst350 (inst350_out, inst212_q);
  nand inst334 (CRC_STRB_L, tu10_cnt4_out[0], tu10_cnt4_out[1], inst335_out, EWFMK_L);
  JKFF inst276 (.CLRN(RDCLR_L), .K(1'b0), .J(1'b1), .CLK(inst350_out), .Q(FME_H));  // open: PRN
  nand inst197 (inst197_out, 1'b1, tm11_den5);
  nand inst189 (tm11_fmk, FMK_CHR_FF_H, tu10_cnt2[3]);
  not inst275 (inst275_out, FME_H);
  DFF inst195 (.CLK(tm11_set), .D(inst197_out), .Q(\7TR_H ));  // open: CLRN, PRN
  not inst374 (debug[4], CRC_STRB_L);
  tu10_count_16bit_aload inst371 (.aclr(~CSET_L), .aload(~1'b1), .clock(\mt-isz ), .q(wr_test_data));  // open: data
  nand inst55 (inst55_out, tu10_cnt1[1], WRC_L, tu10_cnt1[2]);
  nand inst14 (CRCS_CLK_L, tu10_cnt1[0], WRC_L, tu10_cnt1[1]);
  // AND3 inst208 has open pins: IN1=tu10_cnt1[1], IN2=tu10_cnt1[2], IN3=tu10_cnt1[3], OUT=open
  not inst196 (\7TR_L , \7TR_H );
  nand inst210 (RST_FMK_L, FME_H, inst212_q);
  nor inst206 (inst206_out, inst55_out, tu10_cnt1[3]);
  nand inst209 (RDACTV_H, RST_FMK_L, tm11_fmk);
  nor inst207 (TRGR_RDS_L, inst206_out, RSDO_H);
  and inst52 (inst52_out, WRC_L, tu10_cnt1[1], tu10_cnt1[2], tu10_cnt1[3]);
  DFF inst79 (.CLK(RSTSEL_L), .D(tm11_sel[2]), .Q(ESEL_H[2]));  // open: CLRN, PRN
  DFF inst80 (.CLK(RSTSEL_L), .D(tm11_sel[1]), .Q(ESEL_H[1]));  // open: CLRN, PRN
  DFF inst81 (.CLK(RSTSEL_L), .D(tm11_sel[0]), .Q(ESEL_H[0]));  // open: CLRN, PRN
  nand inst290 (inst290_out, tm11_tur, tm11_sdwn, tm11_rws, tm11_selr);
  xnor inst82 (inst82_out, tm11_sel[2], ESEL_H[2]);
  xnor inst83 (inst83_out, tm11_sel[1], ESEL_H[1]);
  xnor inst84 (inst84_out, tm11_sel[0], ESEL_H[0]);
  not inst479 (inst479_out, TRGR_RDS_L);
  nand inst85 (inst85_out, inst82_out, inst83_out, inst84_out);
  and inst283 (inst283_out, inst479_out, RDCLR_L);
  not inst287 (inst287_out, MPCLR_H);
  and inst99 (inst99_out, inst290_out, RSTSEL_L, \mt-sdu );
  DFF inst475 (.CLRN(inst344_aeb_inverted_out), .CLK(inst283_out), .D(1'b1), .Q(debug[14]));  // open: PRN
  and inst286 (inst286_out, inst85_out, inst287_out);
  DFF inst467 (.CLRN(inst303_out), .CLK(inst286_out), .D(1'b1), .Q(RSTSEL_H));  // open: PRN
  count_m307_15us inst435 (.aclr(~debug[14]), .clock(clk_25m), .cnt_en(1'b1), .q(inst435_q));
  and inst304 (inst304_out, clk_25m, tm11_selr);
  count_m307_15us inst432 (.aclr(~RSTSEL_H), .clock(clk_25m), .cnt_en(1'b1), .q(inst432_q));
  count_74123_50ms inst298 (.aclr(~inst99_out), .clock(inst304_out), .q(inst298_q));
  comp_74123_1us inst344 (.dataa(inst435_q), .aeb(inst344_aeb));
  not inst344_aeb_inverted (inst344_aeb_inverted_out, inst344_aeb);
  count_m307_15us inst436 (.aclr(debug[14]), .clock(clk_25m), .cnt_en(debug_tu10[5]), .q(inst436_q));
  not inst476 (tm11_rds, debug[14]);
  comp_74123_5us inst289 (.dataa(inst432_q), .aeb(inst289_aeb));
  not inst289_aeb_inverted (inst289_aeb_inverted_out, inst289_aeb);
  not inst469 (RSTSEL_L, RSTSEL_H);
  comp_74123_50ms inst300 (.dataa(inst298_q), .aeb(inst300_aeb));
  not inst300_aeb_inverted (tm11_selr, inst300_aeb);
  comp_74123_1us inst349 (.dataa(inst436_q), .aeb(inst349_aeb));
  not inst349_aeb_inverted (debug_tu10[5], inst349_aeb);
  and inst303 (inst303_out, inst289_aeb_inverted_out, MOVE_L);
  not inst478 (ERDS_L, debug_tu10[5]);
  sel_decode inst92 (
    .data(ESEL_H), .eq0(inst92_eq0), .eq1(inst92_eq1), .eq2(inst92_eq2), .eq3(inst92_eq3), .eq4(inst92_eq4),
    .eq5(inst92_eq5), .eq6(inst92_eq6), .eq7(inst92_eq7));
  not inst92_eq0_inverted (\mt-vbr-0 , inst92_eq0);
  not inst92_eq1_inverted (\mt-vbr-1 , inst92_eq1);
  not inst92_eq2_inverted (\mt-vbr-2 , inst92_eq2);
  not inst92_eq3_inverted (\mt-vbr-3 , inst92_eq3);
  not inst92_eq4_inverted (\mt-vbr-4 , inst92_eq4);
  not inst92_eq5_inverted (\mt-vbr-5 , inst92_eq5);
  not inst92_eq6_inverted (\mt-vbr-6 , inst92_eq6);
  not inst92_eq7_inverted (\mt-vbr-7 , inst92_eq7);

  assign {debug[5], debug[3:1]} = {\mt-isv , tm11_debug};
  assign debug_tu10[0] = debug[14];
  assign \mt-urz  = led_wr;
  assign \mt-usz  = 1'b1;
  assign tm11_7ch = 1'b1;

  // Other names for the same wires on the sheet: CFOR_H = tm11_fwd; CHR_MATCH_L = debug_tu10[3]; CINIT_H = tm11_cinit;
  //   CRC_STRB_H = debug[4]; CRCE_L = tm11_crce; CRCS_H = debug_tu10[1]; CREV_H = tm11_rev; CREW_H = tm11_rwd;
  //   CSEL_H[2:0] = tm11_sel; CSET_H = tm11_set; CWD_H[7:0] = tm11_wd; CWDR_H = tm11_wdr; CWRE_H = tm11_wre;
  //   EBOT_L = tm11_bot; EEOT_L = tm11_eot; ERD_H[7:0] = debug[13:6]; ERD_IN_H[7:0] = \mt-sv ; ERDP_IN_H = \mt-sv-k ;
  //   ERDS_H = debug_tu10[5]; ERWS_L = tm11_rws; EWRL_L = tm11_wrl; FMK_L = tm11_fmk; FORWARD_L = \mt-udv ;
  //   LRC_MATCH_H = debug_tu10[4]; LRC_STRB_L = \mt-stz ; lrce_l = tm11_lrce; LRCS_H = debug_tu10[2];
  //   LRCS_L = tm11_lrcs; RREW_H = \mt-skl ; RFWD_H = \mt-snl ; MT_SDU_H = \mt-sdu ; MT_SGT_H = \mt-sgt ;
  //   RDS_H = debug[14]; REC_L = \mt-isz ; REVERSE_L = \mt-udn ; REWIND_ON_L = \mt-uvs ; RSDWN_L = tm11_sdwn;
  //   RST_WR_CNT_L = debug[15]; RTUR_L = tm11_tur; RWRE_H = \mt-svs ; RWRL_H = \mt-szz ; SELR_L = tm11_selr;
  //   CRCS_L = tm11_crcs; CDEN5_H = tm11_den5; CDEN8_H = tm11_den8; CPEVN_H = tm11_pevn; RDS_L = tm11_rds;
  //   CWFMK_H = tm11_wfmk; CWEXG_H = tm11_wxg; vpe_l = tm11_vpe; WRC_H = debug[0]; WRITE_ENABLE_L = led_wr;
  //   WRS_L = tm11_wrs; xrd_l[7:0] = tm11_rd; xrdp_l = tm11_rdp; ZW_L[7:0] = \mt-sz ; ZWP_L = \mt-sz-k 

  // Notes on the sheet:
  //   DATA LED
  //   DEC TU10 engineering drawings, page TU17
  //   DATA INPUT LATCHES
  //   LED logic - choose read or write, turn off LEDs when data is not coming in/out.
  //   BYTE PARITY CONTROL
  //   FILE MARKER DETECTOR
  //   LRC CONTROL
  //   800bpi clock divider
  //   Clear this!
  //   USZ is not used.
  //   Always disable 7ch mode for now.
  //   TUR is directly fed from tape drive
  //   This disables SELR
  //   TU10 COMMAND BUFFERS TU13
  //   TRANSPARENT LATCHES!
  //   TU10 CRC AND WRITE GATING TU14
  //   9
  //   8
  //   7
  //   6
  //   5
  //   4
  //   3
  //   2
  //   1
  //   TU10 READ TIMING TU15
  //   PCLR is power supply monitor.
  //   Not used in this case.
  //   Record clock is fixed for test purposes.
  //   TU10 WRITE AND GAP TIMING TU16
  //   CRC CHECKER
  //   1
  //   2
  //   4
  //   5
  //   6
  //   7
  //   8
  //   9
  //   10
  //   MOTION CONTROL M769
  //   Really BOT resets forward? Or EOT?
  //   Without this GND it jumps to forward right after rewind operation
  //   Signal that resets write
  //   CLEAR UP THIS!
endmodule
